# EAGLE schematic untitled (EAGLE 7.6.0)
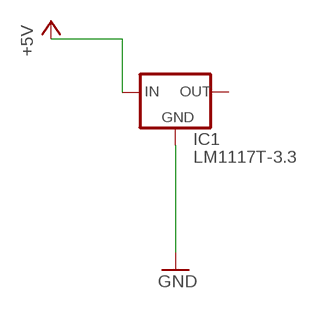
[diagram p0: schematic, sheet 1]

## Parts
IC1  LM1117T-3.3  [TO220]

## Nets
+5V: IC1.3(IN)
GND: IC1.1(GND)
Unconnected: IC1.2(OUT)

## Library data of the parts
IC1 = lm1117:LM1117T-*